# EAGLE design IMU_final (EAGLE 9.6.1)
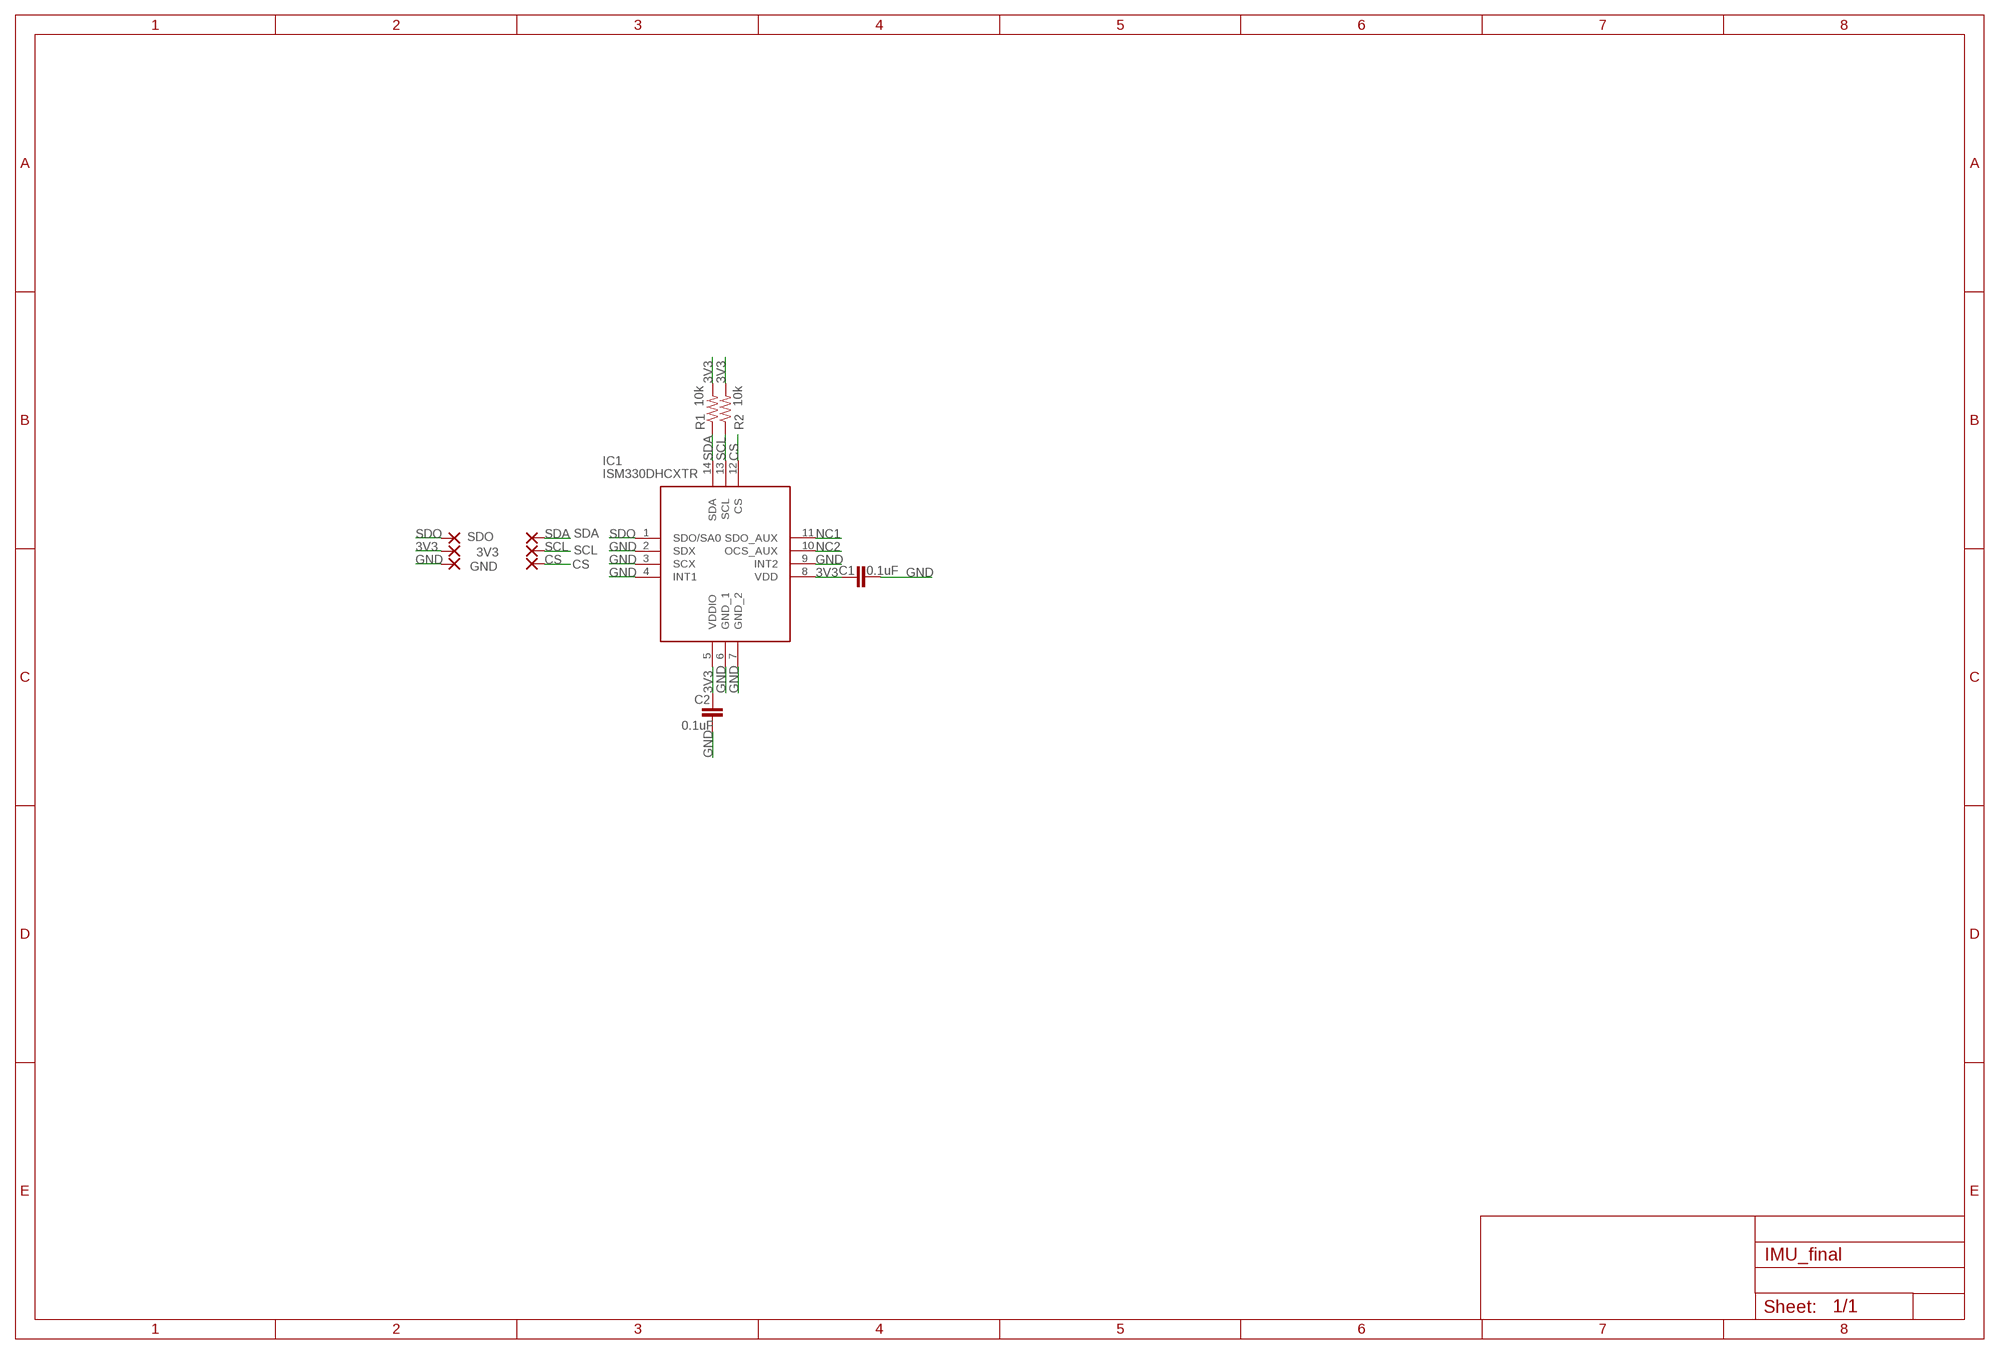
[diagram p0: schematic, sheet 1]

## Parts
3V3  SMD5  [SMD2,54-5,08]
C1  0.1uF  0.1UF-0603-25V-(+80/-20%)  [0603]
C2  0.1uF  0.1UF-0603-25V-(+80/-20%)  [0603]
CS  SMD5  [SMD2,54-5,08]
GND  SMD5  [SMD2,54-5,08]
IC1  ISM330DHCXTR  [LGA-14(2.5X3X0.86)]
R1  10k  10KOHM-0603-1/10W-1%  [0603]
R2  10k  10KOHM-0603-1/10W-1%  [0603]
SCL  SMD5  [SMD2,54-5,08]
SDA  SMD5  [SMD2,54-5,08]
SDO  SMD5  [SMD2,54-5,08]

## Nets
3V3: 3V3.1(P) C1.1 C2.1 IC1.5(VDDIO) IC1.8(VDD) R1.2 R2.2
CS: CS.1(P) IC1.12(CS)
GND: C1.2 C2.2 GND.1(P) IC1.2(SDX) IC1.3(SCX) IC1.4(INT1) IC1.6(GND_1) IC1.7(GND_2) IC1.9(INT2)
NC1: IC1.11(SDO_AUX)
NC2: IC1.10(OCS_AUX)
SCL: IC1.13(SCL) R2.1 SCL.1(P)
SDA: IC1.14(SDA) R1.1 SDA.1(P)
SDO: IC1.1(SDO/SA0) SDO.1(P)

## Library data of the parts
3V3 CS GND SCL SDA SDO = wirepad:SMD5: SMD PAD
C1 C2 = SparkFun-Capacitors:0.1UF: 0.1µF ceramic capacitors A capacitor is a passive two-terminal electrical component used to store electrical energy temporarily in an electric field.; PROD_ID: CAP-00810
IC1 = ISM330DHCXTR:ISM330DHCXTR: IMUs - Inertial Measurement Units VFLGA2.5X3X.86 14L P.5 L.475X.25 Source: Datasheet <https://www.st.com/resource/en/datasheet/ism330dhcx.pdf>; ARROW_PART_NUMBER: ISM330DHCXTR; ARROW_PRICE-STOCK: https://www.arrow.com/en/products/ism330dhcxtr/stmicroelectronics; DESCRIPTION: IMUs - Inertial Measurement Units VFLGA2.5X3X.86 14L P.5 L.475X.25; HEIGHT: mm; MANUFACTURER_NAME: STMicroelectronics; MANUFACTURER_PART_NUMBER: ISM330DHCXTR; MOUSER_PART_NUMBER: 511-ISM330DHCXTR; MOUSER_PRICE-STOCK: https://www.mouser.co.uk/ProductDetail/STMicroelectronics/ISM330DHCXTR?qs=%252B6g0mu59x7Jv2Xps2dM6Xw%3D%3D
R1 R2 = SparkFun-Resistors:10KOHM: 10kΩ resistor A resistor is a passive two-terminal electrical component that implements electrical resistance as a circuit element. Resistors act to reduce current flow, and, at the same time, act to lower voltage levels within circuits. - Wikipedia; PROD_ID: RES-00824

## Board
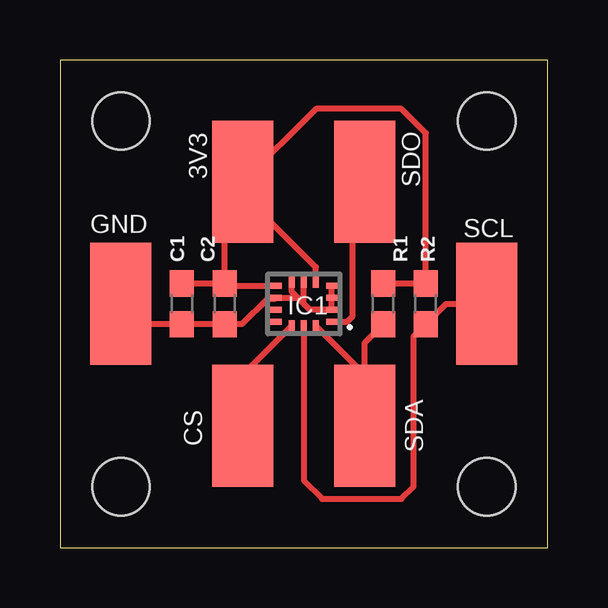
[diagram p1: board, top side]

Size 20.32 x 20.32 mm. Coordinates in mm from the lower left corner, seen from the top.
Outline: 20.32,20.32 0,20.32 0,0 20.32,0 20.32,20.32
Copper layers (1*16): Top 0.035mm / dielectric 1.5mm / Bottom 0.035mm
Design rules "default *": minimum track width 9.5mil, minimum drill 0.35mm, track to track 5mil, track to pad 0.2mm, pad to pad 5mil, via to via 10mil, smd to smd 5mil, copper to edge 40mil, drill to drill 6mil, minimum pad ring 10mil, minimum via ring 8mil, stop-mask expansion 4mil, vias tented up to drill 0mil, thermal gap 10mil
Holes 2.39 mm at 2.54,17.78 2.54,2.54 17.78,17.78 17.78,2.54

### Footprints (pad centres in the part's own frame; a part is rotated, then mirrored left to right if it is on the bottom)
SMD2,54-5,08 = smd 2.54 x 5.08: 1 0,0
0603 = smd 1.1 x 1: 1 -0.85,0; 2 0.85,0
LGA-14(2.5X3X0.86) = smd 0.475 x 0.25: 1 -1.163,0.75; 2 -1.163,0.25; 3 -1.163,-0.25; 4 -1.163,-0.75; 8 1.163,-0.75; 9 1.163,-0.25; 10 1.163,0.25; 11 1.163,0.75 | smd 0.25 x 0.475: 5 -0.5,-0.912; 6 0,-0.912; 7 0.5,-0.912; 12 0.5,0.912; 13 0,0.912; 14 -0.5,0.912

### Placement (x,y rotation side)
3V3  7.62,15.24 180 top
C1  5.08,10.16 270 top
C2  6.86,10.16 270 top
CS  7.62,5.08 0 top
GND  2.54,10.16 0 top
IC1  10.16,10.16 180 top
R1  13.46,10.16 90 top
R2  15.24,10.16 90 top
SCL  17.78,10.16 180 top
SDA  12.7,5.08 180 top
SDO  12.7,15.24 0 top

### Tracks (layer width: path | path; a pad name or v marks a point on that pad's centre or on a via)
3V3
  Top 0.241: R1.2 R2.2 15.24,17.27 14.22,18.29 10.67,18.29 3V3.1 | C1.1 C2.1 | C2.1 6.96,10.91 IC1.8 | IC1.5 10.66,11.69 7.62,14.73 3V3.1 | C2.1 6.86,14.48 3V3.1
CS
  Top 0.241: IC1.12 7.62,7.21 CS.1
GND
  Top 0.241: IC1.4 IC1.3 IC1.2 10.41,9.91 10.16,10.16 | 10.16,10.16 IC1.6 | IC1.7 9.66,10.66 9.91,10.41 | 10.16,10.16 9.91,10.41 | 9.91,10.41 9.9,10.41 IC1.9 8.94,10.36 8.63,10.36 7.58,9.31 C2.2 C1.2 3.39,9.31 GND.1
SCL
  Top 0.241: IC1.13 10.16,2.79 10.92,2.03 14.22,2.03 14.73,2.54 14.73,8.8 R2.1 16.09,10.16 SCL.1
SDA
  Top 0.241: R1.1 12.7,8.55 SDA.1 12.7,7.21 IC1.14
SDO
  Top 0.241: IC1.1 11.93,9.41 11.94,9.4 12.19,9.65 12.19,14.73 SDO.1